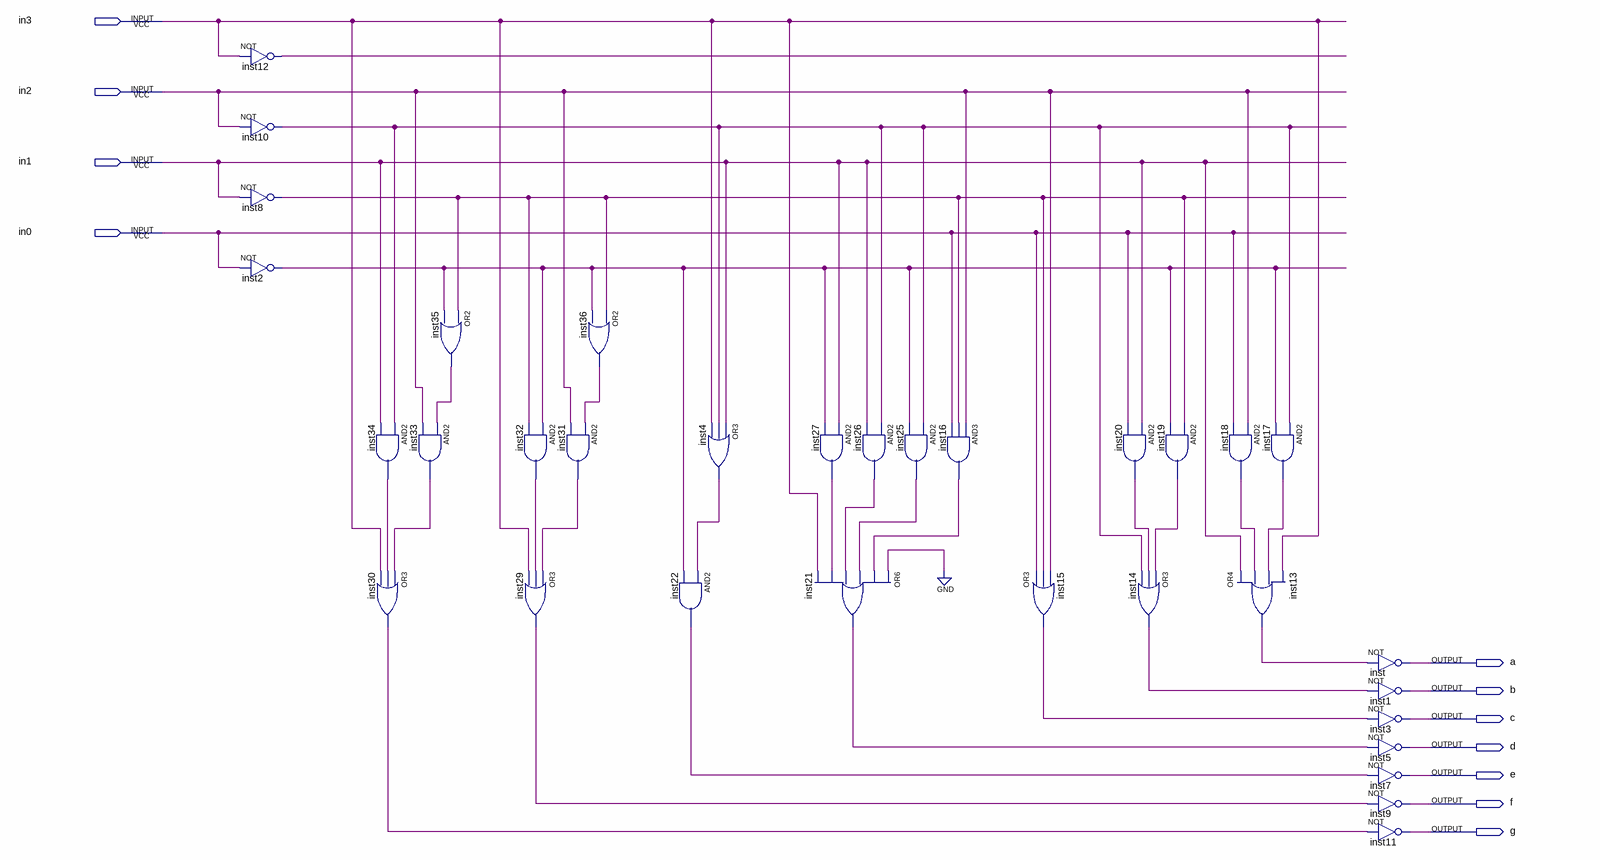
[diagram p0: schematic sheet]
// Quartus schematic dec7seg.bdf as structural Verilog: 33 symbols, 11 pins
module dec7seg (
  input  in3,
  input  in2,
  input  in1,
  input  in0,
  output a,
  output b,
  output c,
  output d,
  output e,
  output f,
  output g
);

  wire inst2_out, inst4_out, inst8_out, inst10_out, inst12_out, inst13_out, inst14_out, inst15_out,
       inst16_out, inst17_out, inst18_out, inst19_out, inst20_out, inst21_out, inst22_out, inst25_out,
       inst26_out, inst27_out, inst29_out, inst30_out, inst31_out, inst32_out, inst33_out, inst34_out,
       inst35_out, inst36_out;

  not inst12 (inst12_out, in3);
  not inst10 (inst10_out, in2);
  not inst8 (inst8_out, in1);
  not inst2 (inst2_out, in0);
  and inst33 (inst33_out, inst35_out, in2);
  and inst34 (inst34_out, inst10_out, in1);
  or inst30 (inst30_out, inst33_out, inst34_out, in3);
  or inst35 (inst35_out, inst8_out, inst2_out);
  and inst32 (inst32_out, inst2_out, inst8_out);
  or inst29 (inst29_out, inst31_out, inst32_out, in3);
  or inst36 (inst36_out, inst8_out, inst2_out);
  and inst31 (inst31_out, inst36_out, in2);
  or inst4 (inst4_out, in1, inst10_out, in3);
  and inst22 (inst22_out, inst4_out, inst2_out);
  and inst27 (inst27_out, in1, inst2_out);
  or inst21 (inst21_out, 1'b0, inst16_out, inst25_out, inst26_out, inst27_out, in3);
  and inst26 (inst26_out, inst10_out, in1);
  and inst25 (inst25_out, inst10_out, inst2_out);
  and inst16 (inst16_out, in2, inst8_out, in0);
  or inst15 (inst15_out, in0, inst8_out, in2);
  and inst20 (inst20_out, in1, in0);
  or inst14 (inst14_out, inst19_out, inst20_out, inst10_out);
  and inst19 (inst19_out, inst8_out, inst2_out);
  and inst17 (inst17_out, inst10_out, inst2_out);
  and inst18 (inst18_out, in2, in0);
  or inst13 (inst13_out, in1, inst18_out, inst17_out, in3);
  not inst (a, inst13_out);
  not inst1 (b, inst14_out);
  not inst3 (c, inst15_out);
  not inst5 (d, inst21_out);
  not inst7 (e, inst22_out);
  not inst9 (f, inst29_out);
  not inst11 (g, inst30_out);
endmodule
